# Altium project CR00026.PrjPCB
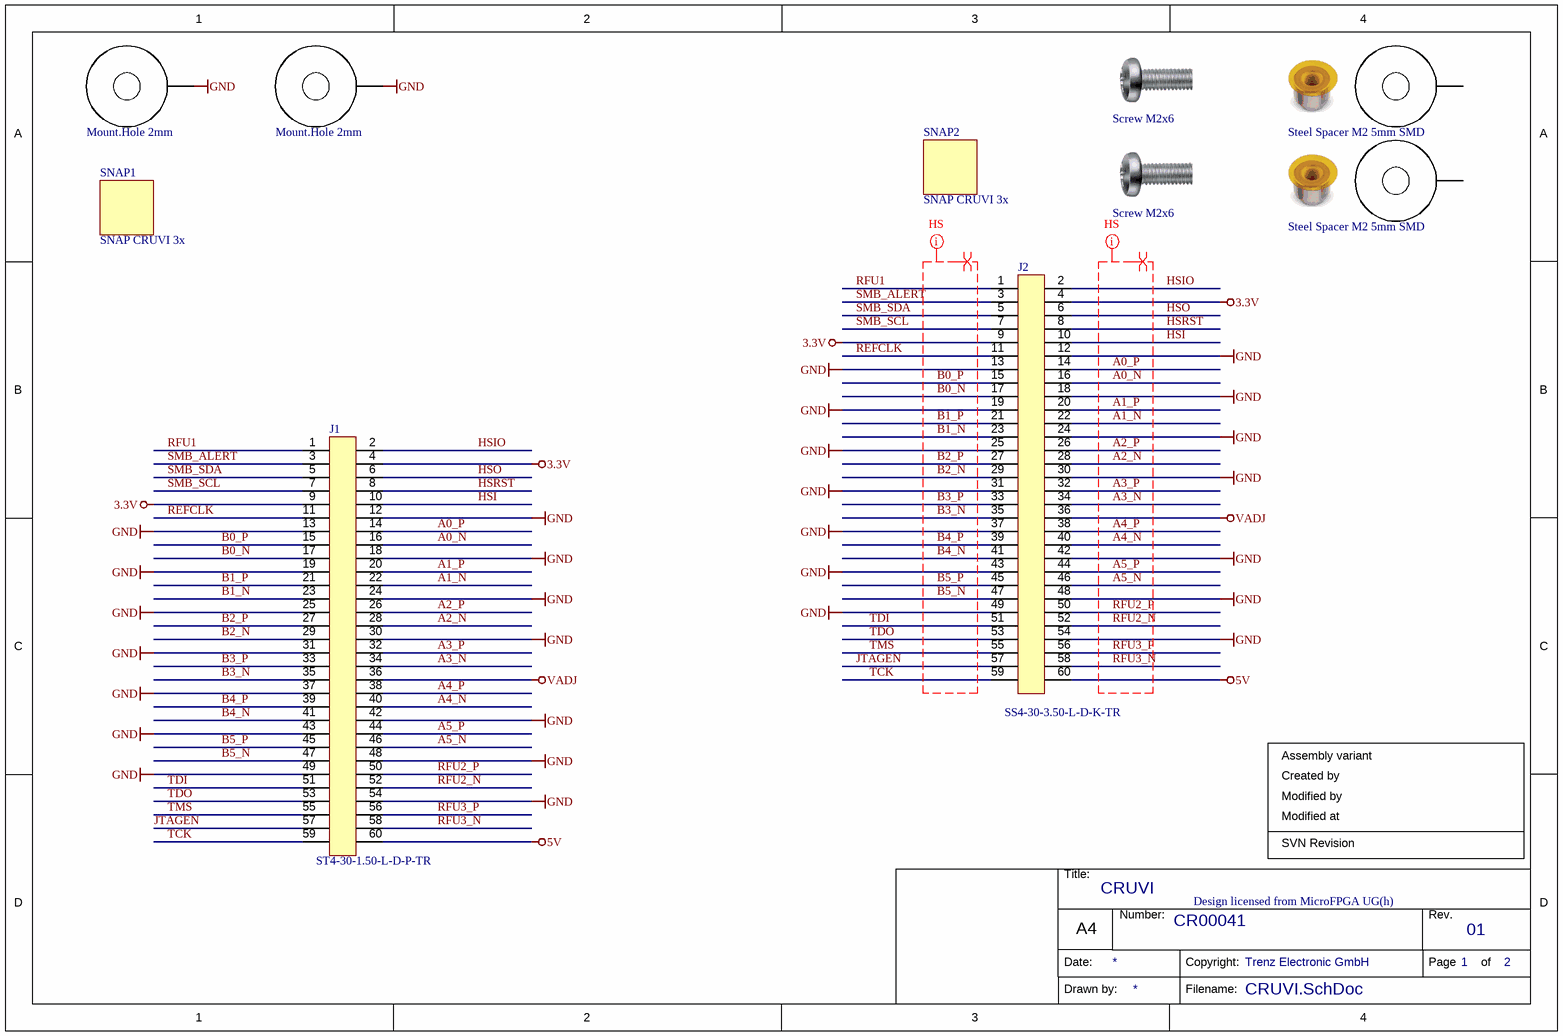
[diagram p0: CRUVI.SchDoc]
Project: CR00026; Revision: 01
2 sheets, 49 parts. Net scope: global (net labels, ports and power ports of the same name join across sheets).
Board file: CR00026.PcbDoc
Sheets:
  CRUVI.SchDoc
  headers.SchDoc

## Sheet CRUVI.SchDoc: CRUVI
size A4; Organization: Trenz Electronic GmbH; DocumentNumber: CR00041; Revision: 01; SheetNumber: 1; SheetTotal: 2; Date: 2019-11-14; CompanyName: Trenz Electronic GmbH

### Parts
H1  Mount.Hole 2mm  [MHole2_2mm]  (no BOM)
H2  Mount.Hole 2mm  [MHole2_2mm]  (no BOM)
H3  Steel Spacer M2 5mm SMD  [9774050243]
H4  Steel Spacer M2 5mm SMD  [9774050243]
J1  ST4-30-1.50-L-D-P-TR  [ST4-30-1_50-L-D]
J2  SS4-30-3.50-L-D-K-TR  [SS4-30-3_50-L-D]
MECH1  Screw M2x6  (mechanical)
MECH2  Screw M2x6  (mechanical)
SNAP1  SNAP CRUVI 3x  [CRUVI_3x_Snap]  (no BOM)
SNAP2  SNAP CRUVI 3x  [CRUVI_3x_Snap]  (no BOM)

### Nets
3.3V: J1.4 J1.9 J2.4 J2.9
5V: J1.60 J2.60
GND: H1.1 H2.1 J1.12 J1.13 J1.18 J1.19 J1.24 J1.25 J1.30 J1.31 J1.37 J1.42 J1.43 J1.48 J1.49 J1.54 J2.12 J2.13 J2.18 J2.19 J2.24 J2.25 J2.30 J2.31 J2.37 J2.42 J2.43 J2.48 J2.49 J2.54
VADJ: J1.36 J2.36
A0_N: J1.16 J2.16
A0_P: J1.14 J2.14
A1_N: J1.22 J2.22
A1_P: J1.20 J2.20
A2_N: J1.28 J2.28
A2_P: J1.26 J2.26
A3_N: J1.34 J2.34
A3_P: J1.32 J2.32
A4_N: J1.40 J2.40
A4_P: J1.38 J2.38
A5_N: J1.46 J2.46
A5_P: J1.44 J2.44
B0_N: J1.17 J2.17
B0_P: J1.15 J2.15
B1_N: J1.23 J2.23
B1_P: J1.21 J2.21
B2_N: J1.29 J2.29
B2_P: J1.27 J2.27
B3_N: J1.35 J2.35
B3_P: J1.33 J2.33
B4_N: J1.41 J2.41
B4_P: J1.39 J2.39
B5_N: J1.47 J2.47
B5_P: J1.45 J2.45
HSI: J1.10 J2.10
HSIO: J1.2 J2.2
HSO: J1.6 J2.6
HSRST: J1.8 J2.8
JTAGEN: J1.57 J2.57
REFCLK: J1.11 J2.11
RFU1: J1.1 J2.1
RFU2_N: J1.52 J2.52
RFU2_P: J1.50 J2.50
RFU3_N: J1.58 J2.58
RFU3_P: J1.56 J2.56
SMB_ALERT: J1.3 J2.3
SMB_SCL: J1.7 J2.7
SMB_SDA: J1.5 J2.5
TCK: J1.59 J2.59
TDI: J1.51 J2.51
TDO: J1.53 J2.53
TMS: J1.55 J2.55

Not connected (* = marked no-connect by the designer): H3 1; H4 1

### Layout directives
differential pair: A0_N, A0_P, A1_N, A1_P, A2_N, A2_P, A3_N, A3_P, A4_N, A4_P, A5_N, A5_P, B0_N, B0_P, B1_N, B1_P, B2_N, B2_P, B3_N, B3_P, B4_N, B4_P, B5_N, B5_P, RFU2_N, RFU2_P, RFU3_N, RFU3_P
net class HS: A0_N, A0_P, A1_N, A1_P, A2_N, A2_P, A3_N, A3_P, A4_N, A4_P, A5_N, A5_P, B0_N, B0_P, B1_N, B1_P, B2_N, B2_P, B3_N, B3_P, B4_N, B4_P, B5_N, B5_P, RFU2_N, RFU2_P, RFU3_N, RFU3_P

### Notes on the sheet
- Assembly variant
- Created by
- Modified at
- Modified by
- SVN Revision
- Design licensed from MicroFPGA UG(h)
- Title:
- Number:
- Rev.
- Date:
- A4
- Copyright:
- Page
- of
- Drawn by:
- Filename:

### Library data of the parts
H1 H2 = 27273: AN: 27273; Mixed: THT
H3 H4 = 29745: 9774050243R; AN: 29745; Mixed: SMT; Extra: SMT Steel Spacer, M2 5mm; HelpURL: b:\AD\adlib\datasheet\9774050243R\; H-ART: 9774050243R
J1 = 29686: AN: 29686; Mixed: SMT; Temperature-Range: -55/+125; Case: ST4; HelpURL: b:\AD\adlib\datasheet\Samtec_ST4\; H-ART: ST4-30-1.50-L-D-P-TR
J2 = 29747: SS4-30-3.50-L-D-K; AN: 29747; Mixed: SMT; Temperature-Range: -55/+125; Extra: Samtec Ultra-Fine Pitch Header 60 pins, 0.4mm pitch, 4.00 mm height; Case: SS4; HelpURL: b:\AD\adlib\datasheet\Samtec_ST4\; H-ART: SS4-30-3.50-L-D-K-TR
MECH1 MECH2 = 26352: Schraube M2x6mm; AN: 26352; Mixed: MECH; Extra: Kreuz, Linsenkopf DIN7985 Edelstahl; HelpURL: b:\AD\adlib\datasheet\Ettinger\
SNAP1 SNAP2 = 29977: SNAP for CRUVI 3x; AN: 29977

## Sheet headers.SchDoc: CRUVI
size A4; Organization: Trenz Electronic GmbH; DocumentNumber: CR00041; Revision: 01; SheetNumber: 1; SheetTotal: 2; Date: 2019-11-14; CompanyName: Trenz Electronic GmbH
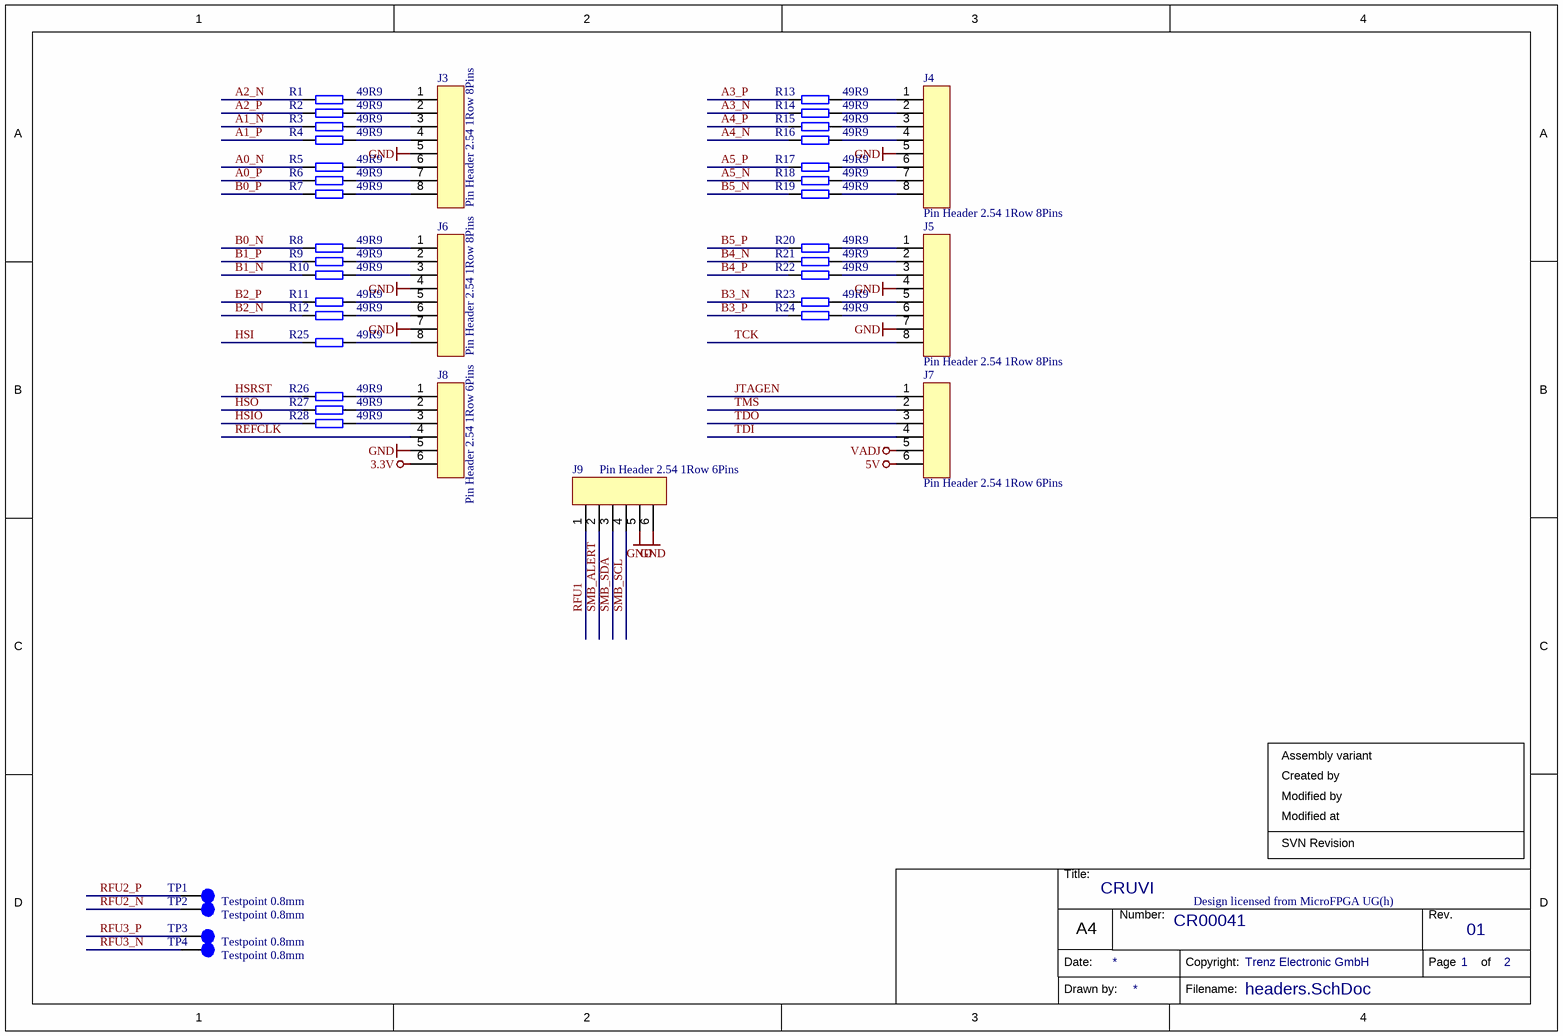
[diagram p1: headers.SchDoc]

### Parts
J3  Pin Header 2.54 1Row 8Pins  [STIFTLEISTE2_54 OG 1R-8V]
J4  Pin Header 2.54 1Row 8Pins  [STIFTLEISTE2_54 OG 1R-8V]
J5  Pin Header 2.54 1Row 8Pins  [STIFTLEISTE2_54 OG 1R-8V]
J6  Pin Header 2.54 1Row 8Pins  [STIFTLEISTE2_54 OG 1R-8V]
J7  Pin Header 2.54 1Row 6Pins  [STIFTLEISTE2_54 OG 1R-6]
J8  Pin Header 2.54 1Row 6Pins  [STIFTLEISTE2_54 OG 1R-6]
J9  Pin Header 2.54 1Row 6Pins  [STIFTLEISTE2_54 OG 1R-6]
R1  49R9  [RESC0603X26N_V]
R2  49R9  [RESC0603X26N_V]
R3  49R9  [RESC0603X26N_V]
R4  49R9  [RESC0603X26N_V]
R5  49R9  [RESC0603X26N_V]
R6  49R9  [RESC0603X26N_V]
R7  49R9  [RESC0603X26N_V]
R8  49R9  [RESC0603X26N_V]
R9  49R9  [RESC0603X26N_V]
R10  49R9  [RESC0603X26N_V]
R11  49R9  [RESC0603X26N_V]
R12  49R9  [RESC0603X26N_V]
R13  49R9  [RESC0603X26N_V]
R14  49R9  [RESC0603X26N_V]
R15  49R9  [RESC0603X26N_V]
R16  49R9  [RESC0603X26N_V]
R17  49R9  [RESC0603X26N_V]
R18  49R9  [RESC0603X26N_V]
R19  49R9  [RESC0603X26N_V]
R20  49R9  [RESC0603X26N_V]
R21  49R9  [RESC0603X26N_V]
R22  49R9  [RESC0603X26N_V]
R23  49R9  [RESC0603X26N_V]
R24  49R9  [RESC0603X26N_V]
R25  49R9  [RESC0603X26N_V]
R26  49R9  [RESC0603X26N_V]
R27  49R9  [RESC0603X26N_V]
R28  49R9  [RESC0603X26N_V]
TP1  Testpoint 0.8mm  [TP_0.8mm]
TP2  Testpoint 0.8mm  [TP_0.8mm]
TP3  Testpoint 0.8mm  [TP_0.8mm]
TP4  Testpoint 0.8mm  [TP_0.8mm]

### Nets
3.3V: J8.6
5V: J7.6
GND: J3.5 J4.5 J5.4 J5.7 J6.4 J6.7 J8.5 J9.5 J9.6
VADJ: J7.5
A0_N: R5.1
A0_P: R6.1
A1_N: R3.1
A1_P: R4.1
A2_N: R1.1
A2_P: R2.1
A3_N: R14.1
A3_P: R13.1
A4_N: R16.1
A4_P: R15.1
A5_N: R18.1
A5_P: R17.1
B0_N: R8.1
B0_P: R7.1
B1_N: R10.1
B1_P: R9.1
B2_N: R12.1
B2_P: R11.1
B3_N: R23.1
B3_P: R24.1
B4_N: R21.1
B4_P: R22.1
B5_N: R19.1
B5_P: R20.1
HSI: R25.1
HSIO: R28.1
HSO: R27.1
HSRST: R26.1
JTAGEN: J7.1
REFCLK: J8.4
RFU1: J9.1
RFU2_N: TP2.1
RFU2_P: TP1.1
RFU3_N: TP4.1
RFU3_P: TP3.1
SMB_ALERT: J9.2
SMB_SCL: J9.4
SMB_SDA: J9.3
TCK: J5.8
TDI: J7.4
TDO: J7.3
TMS: J7.2
NetJ3_1: J3.1 R1.2
NetJ3_2: J3.2 R2.2
NetJ3_3: J3.3 R3.2
NetJ3_4: J3.4 R4.2
NetJ3_6: J3.6 R5.2
NetJ3_7: J3.7 R6.2
NetJ3_8: J3.8 R7.2
NetJ4_1: J4.1 R13.2
NetJ4_2: J4.2 R14.2
NetJ4_3: J4.3 R15.2
NetJ4_4: J4.4 R16.2
NetJ4_6: J4.6 R17.2
NetJ4_7: J4.7 R18.2
NetJ4_8: J4.8 R19.2
NetJ5_1: J5.1 R20.2
NetJ5_2: J5.2 R21.2
NetJ5_3: J5.3 R22.2
NetJ5_5: J5.5 R23.2
NetJ5_6: J5.6 R24.2
NetJ6_1: J6.1 R8.2
NetJ6_2: J6.2 R9.2
NetJ6_3: J6.3 R10.2
NetJ6_5: J6.5 R11.2
NetJ6_6: J6.6 R12.2
NetJ6_8: J6.8 R25.2
NetJ8_1: J8.1 R26.2
NetJ8_2: J8.2 R27.2
NetJ8_3: J8.3 R28.2

### Notes on the sheet
- Assembly variant
- Created by
- Modified at
- Modified by
- SVN Revision
- Design licensed from MicroFPGA UG(h)
- Title:
- Number:
- Rev.
- Date:
- A4
- Copyright:
- Page
- of
- Drawn by:
- Filename:

### Library data of the parts
J3-J6 = 29846: Stiftleiste versetzt 1-reihig, 8pol.; AN: 29846; Mixed: THT; H-ART: 943-12-08-00; Extra: 2,54mm RM, 5,5mm Stiftlänge, vergoldet; Trenz-Stock: Yes; HelpURL: b:\AD\adlib\datasheet\W+P_943_944_945\
J7-J9 = 28042: Stiftleiste gerade 1-reihig, 6pol; AN: 28042; Mixed: THT; H-ART: 943-12-006-00; Extra: 2,54mm RM, 11,3mm Stiftlänge, vergoldet
R1-R28 = 26669: WID SMD 49R9 1% 0,05W BF 0603 (0201); AN: 26669; Voltage: 25V; Mixed: SMT; Trenz-Stock: Yes; Value: 49.9; Tolerance: 1%; Case: 0603 (0201); Technology: TK100; HelpURL: B:\AD\adlib\datasheet\R0201
TP1-TP4 = 26289: AN: 26289; Mixed: MECH

## Nets that join several sheets
3.3V: CRUVI (J1.4 J1.9 J2.4 J2.9), headers (J8.6)
5V: CRUVI (J1.60 J2.60), headers (J7.6)
GND: CRUVI (30 pins), headers (9 pins)
VADJ: CRUVI (J1.36 J2.36), headers (J7.5)
A0_N: CRUVI (J1.16 J2.16), headers (R5.1)
A0_P: CRUVI (J1.14 J2.14), headers (R6.1)
A1_N: CRUVI (J1.22 J2.22), headers (R3.1)
A1_P: CRUVI (J1.20 J2.20), headers (R4.1)
A2_N: CRUVI (J1.28 J2.28), headers (R1.1)
A2_P: CRUVI (J1.26 J2.26), headers (R2.1)
A3_N: CRUVI (J1.34 J2.34), headers (R14.1)
A3_P: CRUVI (J1.32 J2.32), headers (R13.1)
A4_N: CRUVI (J1.40 J2.40), headers (R16.1)
A4_P: CRUVI (J1.38 J2.38), headers (R15.1)
A5_N: CRUVI (J1.46 J2.46), headers (R18.1)
A5_P: CRUVI (J1.44 J2.44), headers (R17.1)
B0_N: CRUVI (J1.17 J2.17), headers (R8.1)
B0_P: CRUVI (J1.15 J2.15), headers (R7.1)
B1_N: CRUVI (J1.23 J2.23), headers (R10.1)
B1_P: CRUVI (J1.21 J2.21), headers (R9.1)
B2_N: CRUVI (J1.29 J2.29), headers (R12.1)
B2_P: CRUVI (J1.27 J2.27), headers (R11.1)
B3_N: CRUVI (J1.35 J2.35), headers (R23.1)
B3_P: CRUVI (J1.33 J2.33), headers (R24.1)
B4_N: CRUVI (J1.41 J2.41), headers (R21.1)
B4_P: CRUVI (J1.39 J2.39), headers (R22.1)
B5_N: CRUVI (J1.47 J2.47), headers (R19.1)
B5_P: CRUVI (J1.45 J2.45), headers (R20.1)
HSI: CRUVI (J1.10 J2.10), headers (R25.1)
HSIO: CRUVI (J1.2 J2.2), headers (R28.1)
HSO: CRUVI (J1.6 J2.6), headers (R27.1)
HSRST: CRUVI (J1.8 J2.8), headers (R26.1)
JTAGEN: CRUVI (J1.57 J2.57), headers (J7.1)
REFCLK: CRUVI (J1.11 J2.11), headers (J8.4)
RFU1: CRUVI (J1.1 J2.1), headers (J9.1)
RFU2_N: CRUVI (J1.52 J2.52), headers (TP2.1)
RFU2_P: CRUVI (J1.50 J2.50), headers (TP1.1)
RFU3_N: CRUVI (J1.58 J2.58), headers (TP4.1)
RFU3_P: CRUVI (J1.56 J2.56), headers (TP3.1)
SMB_ALERT: CRUVI (J1.3 J2.3), headers (J9.2)
SMB_SCL: CRUVI (J1.7 J2.7), headers (J9.4)
SMB_SDA: CRUVI (J1.5 J2.5), headers (J9.3)
TCK: CRUVI (J1.59 J2.59), headers (J5.8)
TDI: CRUVI (J1.51 J2.51), headers (J7.4)
TDO: CRUVI (J1.53 J2.53), headers (J7.3)
TMS: CRUVI (J1.55 J2.55), headers (J7.2)

## Assembly variants
1: not fitted J3 J4 J5 J6 J7 J8 J9; alternate parts U1 -> 29136
0: not fitted J3 J4 J5 J6 J7 J8 J9 U1